# Altium schematic sheet Sheet_1_2021-12-20.schdoc
size 49 x 27 mm
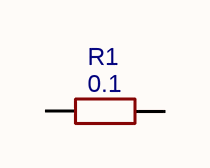
[diagram p0: Sheet_1_2021-12-20.schdoc]

## Parts
R1  0.1  [R1206]

## Nets

Not connected (* = marked no-connect by the designer): R1 1 2

## Library data of the parts
R1 = 0.1: BOM_Manufacturer: UniOhm; BOM_Manufacturer Part: 1206W4F100LT5E; nameAlias: Resistance (Ohms); BOM_Supplier: LCSC; BOM_Supplier Part: C25334; BOM_JLCPCB Part Class: Basic Part; spicePre: R; spiceSymbolName: 1206W4F100LT5E